# EAGLE design TRDR (EAGLE 5.11)
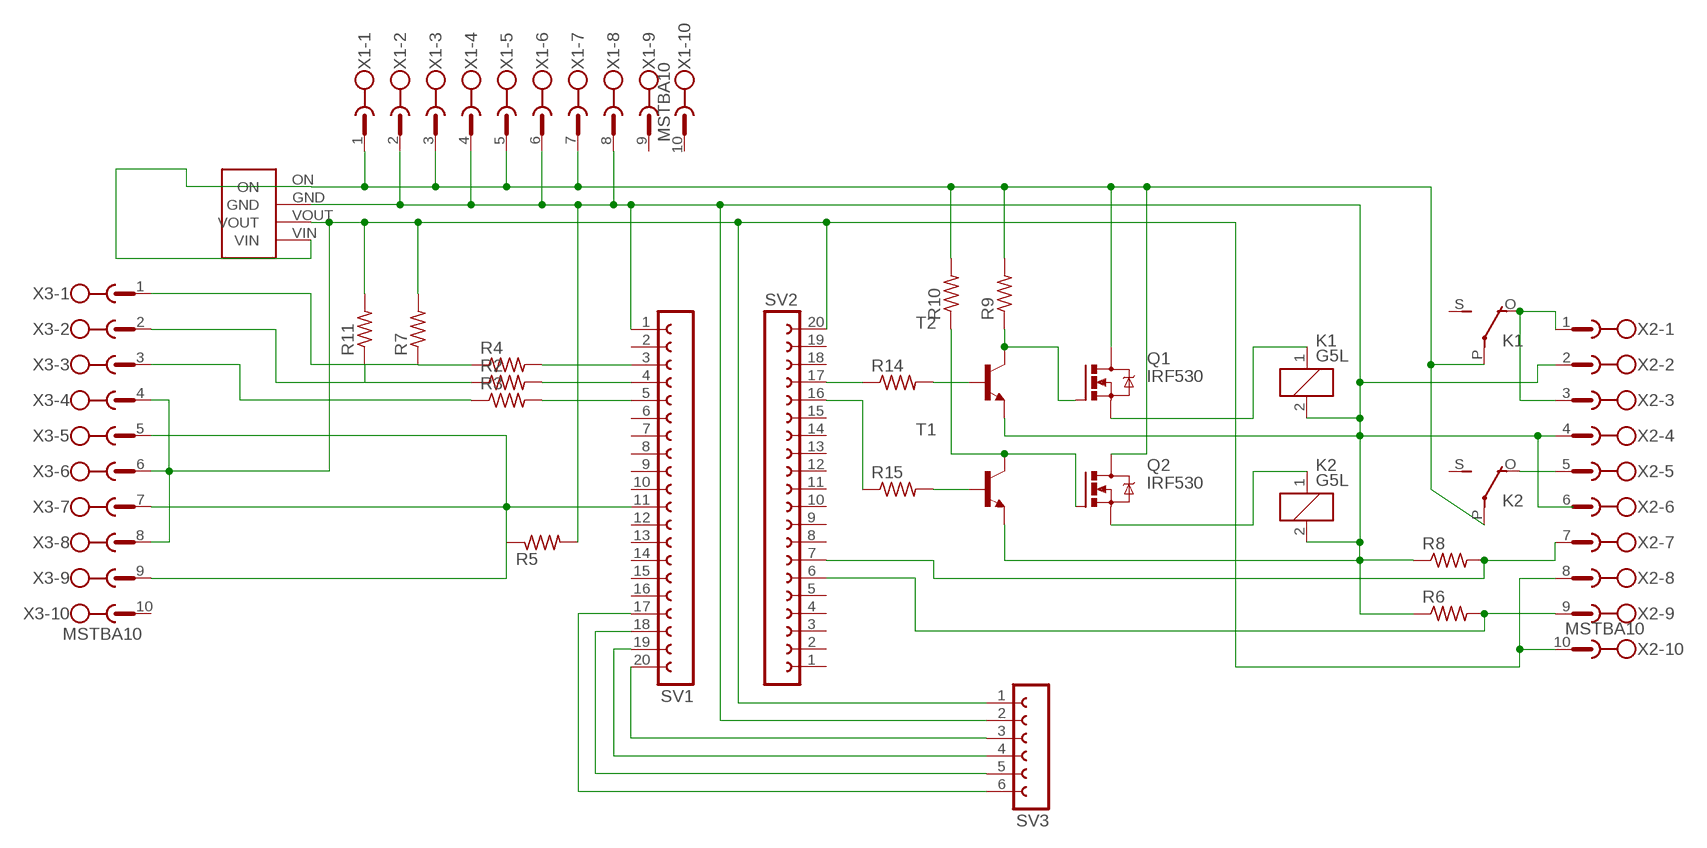
[diagram p0: schematic, sheet 1]

## Parts
K1  G5L  [G5LE]
K2  G5L  [G5LE]
Q1  IRF530  [TO220BV]
Q2  IRF530  [TO220BV]
R2  R-US_0207/10  [0207/10]
R3  R-US_0207/10  [0207/10]
R4  R-US_0207/10  [0207/10]
R5  R-US_0207/10  [0207/10]
R6  R-US_0207/10  [0207/10]
R7  R-US_0207/10  [0207/10]
R8  R-US_0207/10  [0207/10]
R9  R-US_0207/10  [0207/10]
R10  R-US_0207/10  [0207/10]
R11  R-US_0207/10  [0207/10]
R14  R-US_0207/10  [0207/10]
R15  R-US_0207/10  [0207/10]
SV1  FE20-1  [FE20]
SV2  FE20-1  [FE20]
SV3  FE06-1  [FE06]
T1  -NPN-TO92  [TO92]
T2  -NPN-TO92  [TO92]
U$1  050RDA1  [TO220-4A]
X1  MSTBA10  [MSTBA10]
X2  MSTBA10  [MSTBA10]
X3  MSTBA10  [MSTBA10]

## Nets
N$1: R14.1 SV2.17
N$2: R15.1 SV2.16
N$3: K1.2 K2.2 R5.2 R6.1 R8.1 SV1.1 SV3.2 T1.1(E) T2.1(E) U$1.GND X1.2 X1.4 X1.6 X1.8 X2.2 X2.4
N$4: R14.2 T2.2(B)
N$5: R5.1 SV1.11 X3.5 X3.7 X3.9
N$6: R7.2 R11.2 SV2.20 SV3.1 U$1.VOUT X2.8 X2.10 X3.4 X3.6 X3.8
N$7: R4.1 R7.1 X3.1
N$8: R2.1 R11.1 X3.2
N$9: R4.2 SV1.3
N$10: R2.2 SV1.4
N$11: R3.2 SV1.5
N$12: R15.2 T1.2(B)
N$13: Q1.G R9.1 T2.3(C)
N$14: R3.1 X3.3
N$15: Q2.G R10.1 T1.3(C)
N$16: K1.O(2:O) X2.1 X2.3
N$17: K2.O(2:O) X2.5
N$18: SV1.17 SV3.6
N$19: K1.P(2:P) K2.P(2:P) Q1.D Q2.D R9.2 R10.2 U$1.ON U$1.VIN X1.1 X1.3 X1.5 X1.7
N$20: SV1.18 SV3.5
N$21: R8.2 SV2.7 X2.7
N$22: R6.2 SV2.6 X2.9
N$23: SV1.19 SV3.4
N$24: SV1.20 SV3.3
N$26: K1.1 Q1.S
N$27: K2.1 Q2.S
Unconnected: K1.S(2:S) K2.S(2:S) SV1.2 SV1.6 SV1.7 SV1.8 SV1.9 SV1.10 SV1.12 SV1.13 SV1.14 SV1.15 SV1.16 SV2.1 SV2.2 SV2.3 SV2.4 SV2.5 SV2.8 SV2.9 SV2.10 SV2.11 SV2.12 SV2.13 SV2.14 SV2.15 SV2.18 SV2.19 X1.9 X1.10 X2.6 X3.10

## Library data of the parts
K1 K2 = relay:G5L: RELAY 1 x switch, 10 A/120 V AC, 8 A/30 V ADC, Omron; OC_FARNELL: unknown; OC_NEWARK: unknown
Q1 Q2 = transistor-power:IRF530: HEXFET Power MOSFET
R2-R11 R14 R15 = resistor:R-US_: RESISTOR, American symbol
SV1 SV2 = con-lsta:FE20-1: FEMALE HEADER; OC_FARNELL: unknown; OC_NEWARK: unknown
SV3 = con-lsta:FE06-1: FEMALE HEADER; OC_FARNELL: unknown; OC_NEWARK: unknown
T1 T2 = transistor:*-NPN-: NPN Transistror BF959 corrected 2008.03.06
U$1 = rtavk3:050RDA1
X1-X3 = con-phoenix-508:MSTBA10: PHOENIX; MF: FARNELL; MPN: 1757323; OC_FARNELL: 3705249; OC_NEWARK: 71C4168

## Board
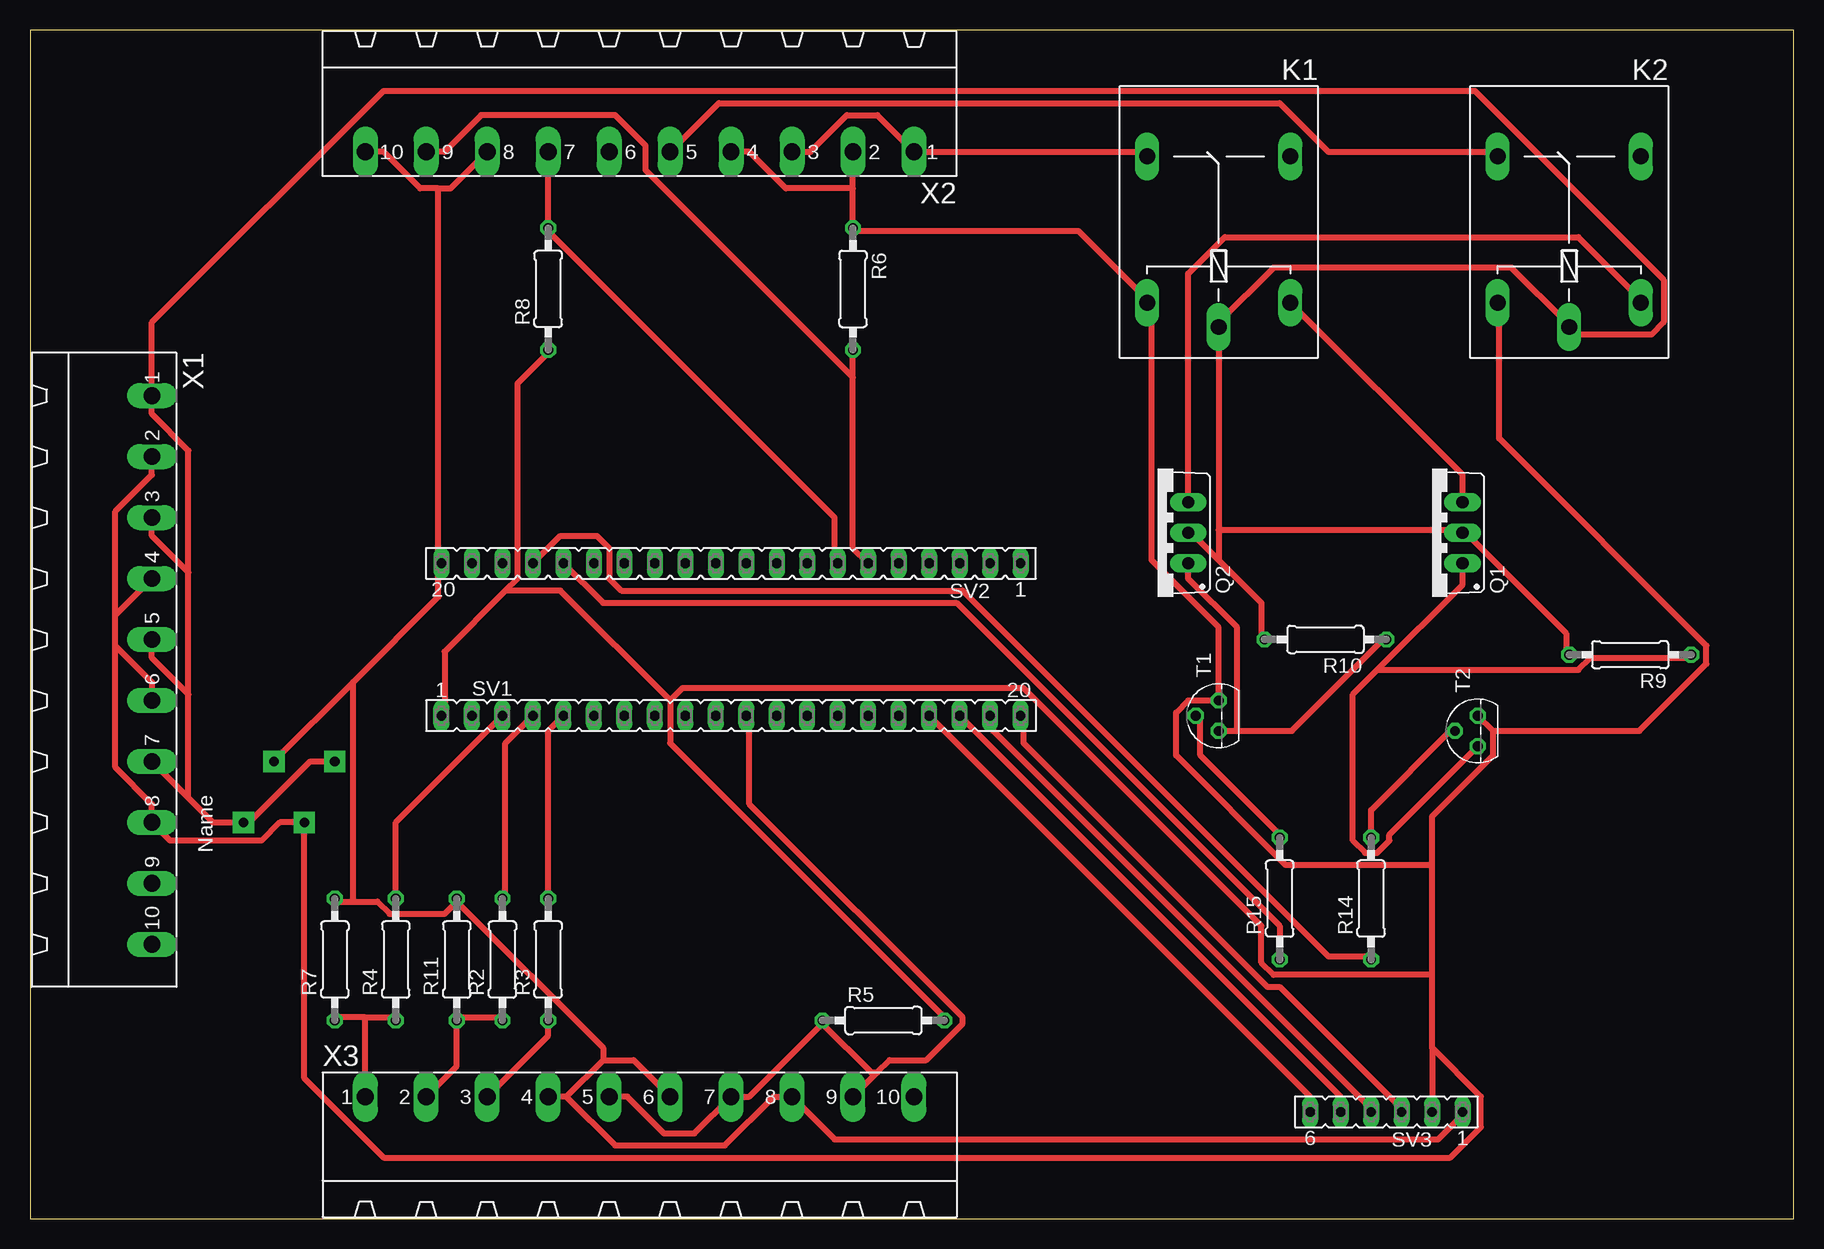
[diagram p1: board, top side]

Size 146.99 x 99.05 mm. Coordinates in mm from the lower left corner, seen from the top.
Outline: 0,0 146.99,0 146.99,99.05 0,99.05 0,0
Copper layers (1*16): Top 0.035mm / dielectric 1.5mm / Bottom 0.035mm
Design rules "default *": minimum track width 20mil, minimum drill 24mil, track to track 20mil, track to pad 12mil, pad to pad 8mil, via to via 8mil, smd to smd 8mil, copper to edge 40mil, drill to drill 8mil, minimum pad ring 10mil, minimum via ring 8mil, stop-mask expansion 4mil, vias tented up to drill 0mil, thermal gap 10mil

### Footprints (pad centres in the part's own frame; a part is rotated, then mirrored left to right if it is on the bottom)
G5LE = drill 1.321 long: 1 -7.493,-5.969; 2 -7.493,5.969; O 4.699,5.969; P -9.525,0; S 4.699,-5.969
TO220BV = drill 1.016 long: D 0,-2.54; G -2.54,-2.54; S 2.54,-2.54
0207/10 = drill 0.813 octagon: 1 -5.08,0; 2 5.08,0
FE20 = drill 0.813 long: 1 -24.13,0; 2 -21.59,0; 3 -19.05,0; 4 -16.51,0; 5 -13.97,0; 6 -11.43,0; 7 -8.89,0; 8 -6.35,0; 9 -3.81,0; 10 -1.27,0; 11 1.27,0; 12 3.81,0; 13 6.35,0; 14 8.89,0; 15 11.43,0; 16 13.97,0; 17 16.51,0; 18 19.05,0; 19 21.59,0; 20 24.13,0
FE06 = drill 0.813 long: 1 -6.35,0; 2 -3.81,0; 3 -1.27,0; 4 1.27,0; 5 3.81,0; 6 6.35,0
TO92 = drill 0.813 octagon: 1 1.27,0; 2 0,1.905; 3 -1.27,0
TO220-4A = drill 0.8 pad 1.778 square: GND -2.54,-1.27; ON 2.54,-3.81; VIN -2.54,3.81; VOUT 2.54,1.27
MSTBA10 = drill 1.397 long: 1 -22.86,5.08; 2 -17.78,5.08; 3 -12.7,5.08; 4 -7.62,5.08; 5 -2.54,5.08; 6 2.54,5.08; 7 7.62,5.08; 8 12.7,5.08; 9 17.78,5.08; 10 22.86,5.08

### Placement (x,y rotation side)
K1  99.06,83.82 90 top
K2  128.27,83.82 90 top
Q1  116.84,57.15 90 top
Q2  93.98,57.15 90 top
R2  39.37,21.59 90 top
R3  43.18,21.59 90 top
R4  30.48,21.59 90 top
R5  71.12,16.51 0 top
R6  68.58,77.47 270 top
R7  25.4,21.59 90 top
R8  43.18,77.47 90 top
R9  133.35,46.99 180 top
R10  107.95,48.26 180 top
R11  35.56,21.59 90 top
R14  111.76,26.67 90 top
R15  104.14,26.67 90 top
SV1  58.42,41.91 0 top
SV2  58.42,54.61 180 top
SV3  113.03,8.89 180 top
T1  99.06,41.91 90 top
T2  120.65,40.64 90 top
U$1  21.59,35.56 90 top
X1  5.08,45.72 270 top
X2  50.8,93.98 180 top
X3  50.8,5.08 0 top

### Tracks (layer width: path | path; a pad name or v marks a point on that pad's centre or on a via)
N$1
  Top 0.508: R14.1 111.76,21.84 108.2,21.84 77.72,52.32 49.28,52.32 48.26,53.34 48.26,55.88 47.24,56.9 44.2,56.9 SV2.17
N$2
  Top 0.508: R15.1 104.14,24.38 77.22,51.31 47.75,51.31 SV2.16
N$3
  Top 0.508: 39.62,52.32 40.64,53.34 40.64,69.6 43.18,72.14 R8.1 | 39.62,52.32 34.54,47.24 34.54,42.16 SV1.1 | 53.34,43.18 53.34,39.62 76.2,16.76 R5.2 | 53.34,43.18 44.2,52.32 39.62,52.32 | 68.58,85.85 X2.2 | 68.58,85.85 R6.1 68.58,82.3 87.38,82.3 92.96,76.71 K1.2 93.47,76.2 93.47,54.86 99.06,49.28 T1.1 96.52,43.18 95.5,42.16 95.5,38.61 104.65,29.46 116.84,29.46 | X2.4 59.94,88.9 62.99,85.85 68.58,85.85 | X1.6 10.16,44.7 7.11,47.75 | 7.11,47.75 7.11,50.29 | 7.11,50.29 X1.4 | X1.2 10.16,61.98 7.11,58.93 7.11,50.29 | 7.11,47.75 7.11,37.59 10.16,34.54 X1.8 11.68,31.5 19.3,31.5 20.83,33.02 U$1.GND 22.86,11.68 29.46,5.08 118.36,5.08 120.9,7.62 120.9,10.16 116.84,14.22 | 116.84,29.46 116.84,33.53 121.92,38.61 121.92,40.64 | 116.84,20.32 116.84,29.46 | 116.84,14.22 116.84,20.32 | 116.84,14.22 SV3.2 | 121.92,40.64 T2.1 | 121.92,40.64 134.11,40.64 139.7,46.23 139.7,47.75 122.43,65.02 122.43,76.2 K2.2 | 53.34,43.18 54.36,44.2 82.8,44.2 102.62,24.38 102.62,21.34 103.63,20.32 116.84,20.32
N$4
  Top 0.508: R14.2 111.76,34.04 118.36,40.64 T2.2
N$5
  Top 0.508: X3.5 49.78,10.16 52.83,7.11 55.37,7.11 X3.7 59.94,10.16 66.04,16.26 | 70.61,12.19 X3.9 | 70.61,12.19 71.63,13.21 74.68,13.21 77.72,16.26 77.72,16.76 59.94,34.54 59.94,41.66 SV1.11 | 66.04,16.26 70.1,12.19 70.61,12.19 | 66.04,16.26 R5.1
N$6
  Top 0.508: SV3.1 119.38,8.64 117.35,6.6 67.06,6.6 X3.8 61.98,10.16 57.91,6.1 48.77,6.1 44.7,10.16 | 44.7,10.16 X3.4 | 47.75,13.21 44.7,10.16 | 47.75,13.21 50.29,13.21 X3.6 | X2.10 29.46,88.9 32.51,85.85 34.04,85.85 | 34.04,85.85 35.05,85.85 X2.8 | 26.92,26.42 28.96,26.42 29.97,25.4 34.54,25.4 35.56,26.42 | 26.92,26.42 25.4,26.42 R7.2 | 26.92,44.7 U$1.VOUT | 26.92,44.7 34.04,51.82 34.04,54.36 SV2.20 34.04,54.86 34.04,85.85 | 26.92,26.42 26.92,44.7 | 47.75,13.21 47.75,14.22 35.56,26.42 | 35.56,26.42 R11.2
N$7
  Top 0.508: 27.94,16.76 30.48,16.76 R4.1 | 27.94,16.76 25.4,16.76 R7.1 | X3.1 27.94,16.76
N$8
  Top 0.508: R2.1 39.12,16.76 35.56,16.76 R11.1 35.56,12.7 X3.2
N$9
  Top 0.508: R4.2 30.48,33.02 SV1.3
N$10
  Top 0.508: R2.2 39.62,26.92 39.62,39.62 SV1.4
N$11
  Top 0.508: R3.2 43.18,40.64 SV1.5
N$12
  Top 0.508: T1.2 97.54,41.66 97.54,38.61 104.14,32 R15.2
N$13
  Top 0.508: 112.27,45.72 119.38,52.83 Q1.G | 112.27,45.72 110.24,43.69 110.24,31.5 111.25,30.48 112.27,30.48 113.28,31.5 113.28,32 T2.3 | 112.27,45.72 129.03,45.72 130.05,46.74 138.18,46.74 R9.1
N$14
  Top 0.508: X3.3 43.18,15.24 R3.1
N$15
  Top 0.508: 100.58,40.64 105.16,40.64 112.78,48.26 R10.1 | T1.3 100.58,40.64 | 100.58,40.64 100.58,49.28 96.52,53.34 Q2.G
N$16
  Top 0.508: K1.O 92.96,88.9 X2.1 70.61,91.95 68.07,91.95 65.02,88.9 X2.3
N$17
  Top 0.508: X2.5 57.4,92.96 104.14,92.96 108.2,88.9 121.92,88.9 K2.O
N$18
  Top 0.508: SV3.6 106.68,10.16 SV1.17
N$19
  Top 0.508: 13.21,35.05 X1.7 | 13.21,35.05 15.24,33.02 U$1.VIN 18.29,33.02 23.37,38.1 U$1.ON | X1.5 10.16,46.74 13.21,43.69 | 13.21,35.05 13.21,43.69 | X1.3 10.16,56.9 13.21,53.85 | 13.21,43.69 13.21,53.85 | 13.21,53.85 13.21,64.01 10.16,67.06 X1.1 10.16,74.68 29.46,93.98 120.4,93.98 136.14,78.23 136.14,74.68 135.13,73.66 129.03,73.66 128.52,74.17 K2.P 128.02,74.68 123.44,79.25 103.63,79.25 99.06,74.68 K1.P 99.06,57.4 | 119.38,57.4 128.02,48.77 128.02,47.24 R9.2 | 99.06,54.86 96.52,57.4 Q2.D | 99.06,54.86 102.62,51.31 102.62,48.26 R10.2 | 99.06,57.4 99.06,54.86 | 99.06,57.4 119.38,57.4 | 119.38,57.4 Q1.D
N$20
  Top 0.508: SV3.5 109.22,10.16 SV1.18
N$21
  Top 0.508: X2.7 R8.2 43.18,82.3 67.06,58.42 67.06,54.86 SV2.7
N$22
  Top 0.508: 68.58,70.1 68.58,55.88 SV2.6 | 68.58,70.1 R6.2 | X2.9 34.54,88.9 37.59,91.95 48.77,91.95 51.31,89.41 51.31,87.38 68.58,70.1
N$23
  Top 0.508: SV1.19 80.26,41.66 80.26,40.64 111.76,9.14 SV3.4
N$24
  Top 0.508: SV3.3 114.3,9.14 104.14,19.3 103.12,19.3 82.8,39.62 82.8,41.66 SV1.20
N$26
  Top 0.508: Q1.S 119.38,61.98 K1.1
N$27
  Top 0.508: Q2.S 96.52,78.74 99.57,81.79 129.03,81.79 134.11,76.71 K2.1